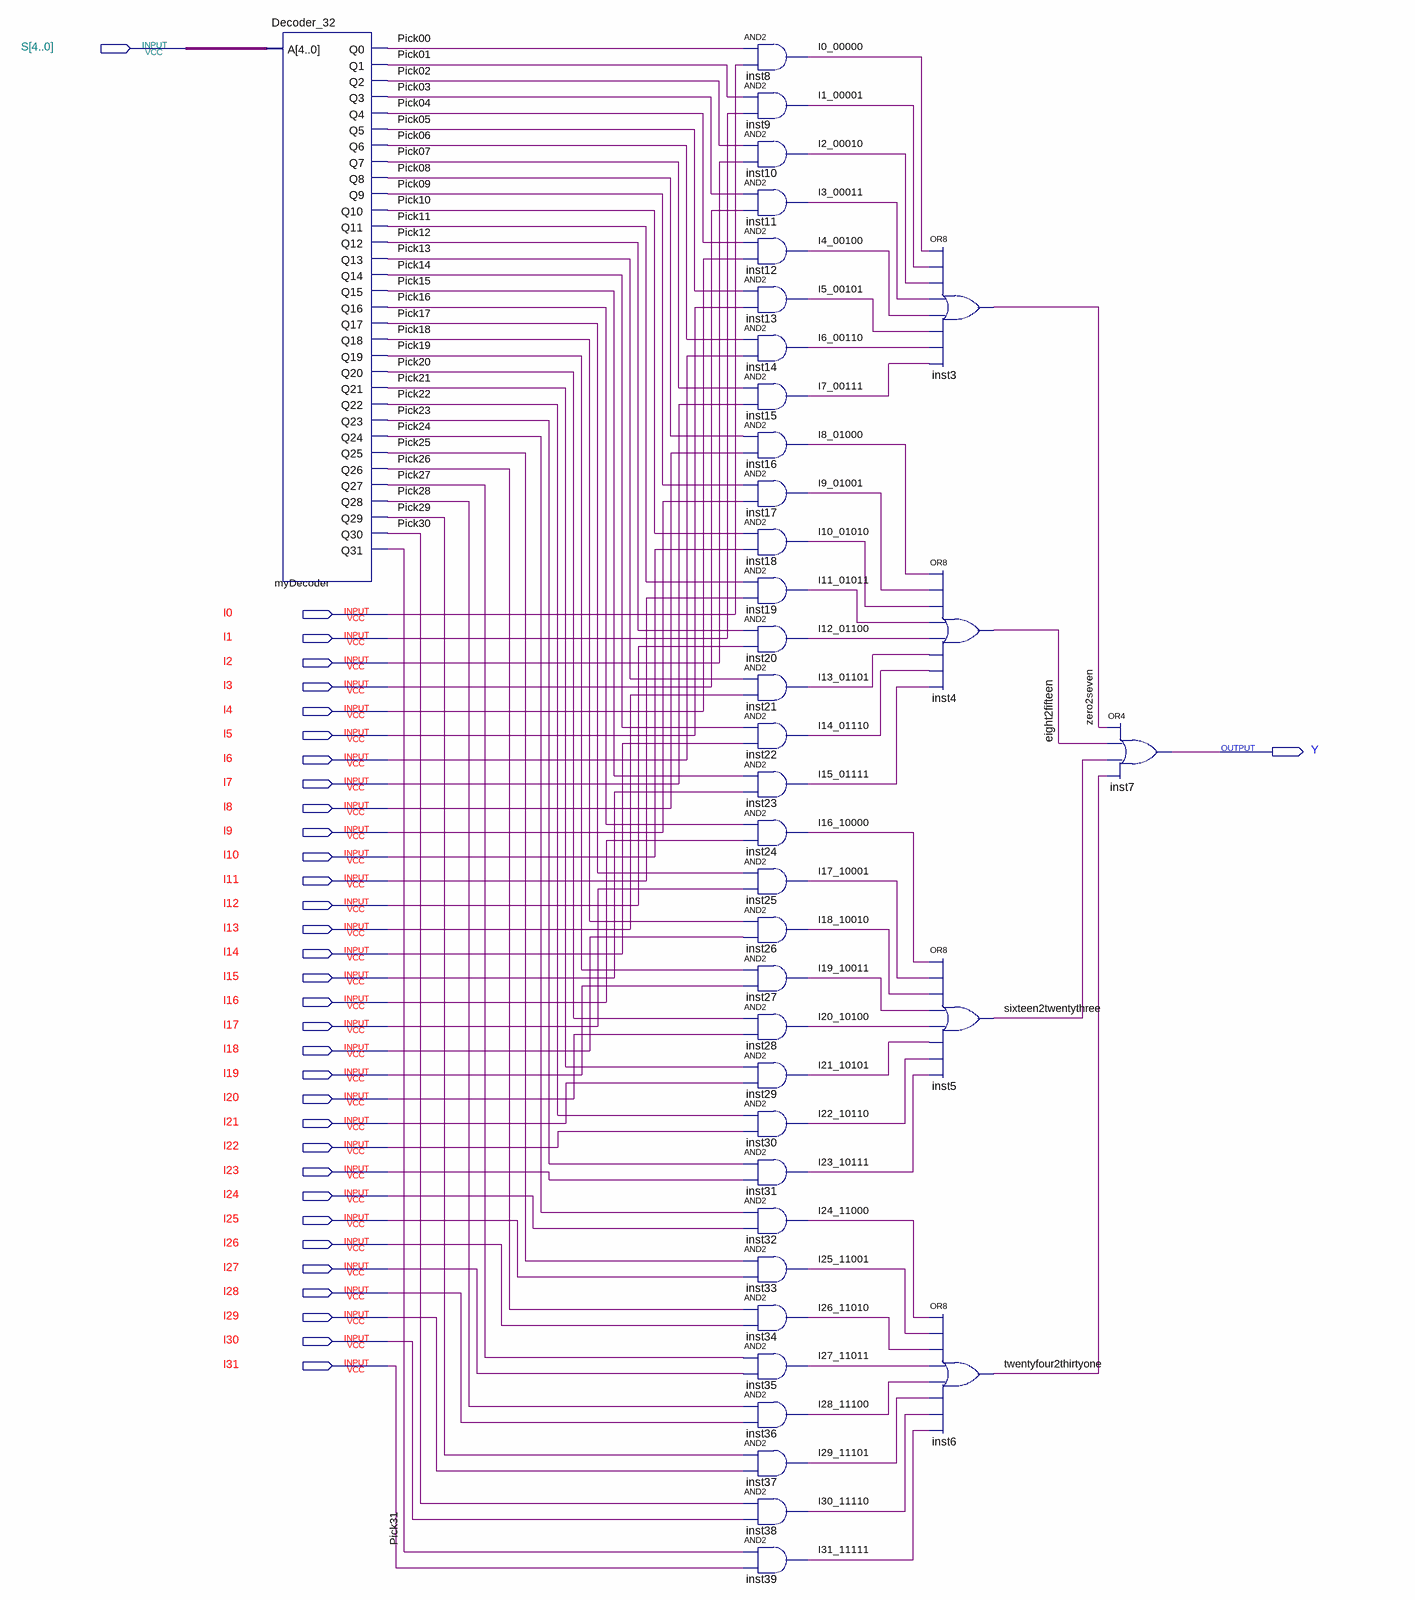
[diagram p0: schematic sheet]
// Quartus schematic MUX32.bdf as structural Verilog: 38 symbols, 34 pins
module MUX32 (
  input  [4:0] S,
  input  I0,
  input  I1,
  input  I2,
  input  I3,
  input  I4,
  input  I5,
  input  I6,
  input  I7,
  input  I8,
  input  I9,
  input  I10,
  input  I11,
  input  I12,
  input  I13,
  input  I14,
  input  I15,
  input  I16,
  input  I17,
  input  I18,
  input  I19,
  input  I20,
  input  I21,
  input  I22,
  input  I23,
  input  I24,
  input  I25,
  input  I26,
  input  I27,
  input  I28,
  input  I29,
  input  I30,
  input  I31,
  output Y
);

  wire eight2fifteen, I0_00000, I1_00001, I2_00010, I3_00011, I4_00100, I5_00101, I6_00110, I7_00111,
       I8_01000, I9_01001, I10_01010, I11_01011, I12_01100, I13_01101, I14_01110, I15_01111, I16_10000,
       I17_10001, I18_10010, I19_10011, I20_10100, I21_10101, I22_10110, I23_10111, I24_11000, I25_11001,
       I26_11010, I27_11011, I28_11100, I29_11101, I30_11110, I31_11111, Pick00, Pick01, Pick02, Pick03,
       Pick04, Pick05, Pick06, Pick07, Pick08, Pick09, Pick10, Pick11, Pick12, Pick13, Pick14, Pick15,
       Pick16, Pick17, Pick18, Pick19, Pick20, Pick21, Pick22, Pick23, Pick24, Pick25, Pick26, Pick27,
       Pick28, Pick29, Pick30, Pick31, sixteen2twentythree, twentyfour2thirtyone, zero2seven;

  Decoder_32 myDecoder (
    .A(S), .Q0(Pick00), .Q1(Pick01), .Q2(Pick02), .Q3(Pick03), .Q4(Pick04), .Q5(Pick05), .Q6(Pick06),
    .Q7(Pick07), .Q8(Pick08), .Q9(Pick09), .Q10(Pick10), .Q11(Pick11), .Q12(Pick12), .Q13(Pick13),
    .Q14(Pick14), .Q15(Pick15), .Q16(Pick16), .Q17(Pick17), .Q18(Pick18), .Q19(Pick19), .Q20(Pick20),
    .Q21(Pick21), .Q22(Pick22), .Q23(Pick23), .Q24(Pick24), .Q25(Pick25), .Q26(Pick26), .Q27(Pick27),
    .Q28(Pick28), .Q29(Pick29), .Q30(Pick30), .Q31(Pick31));
  and inst8 (I0_00000, Pick00, I0);
  and inst9 (I1_00001, Pick01, I1);
  and inst10 (I2_00010, Pick02, I2);
  and inst11 (I3_00011, Pick03, I3);
  and inst12 (I4_00100, Pick04, I4);
  and inst13 (I5_00101, Pick05, I5);
  and inst14 (I6_00110, Pick06, I6);
  and inst15 (I7_00111, Pick07, I7);
  and inst16 (I8_01000, Pick08, I8);
  and inst17 (I9_01001, Pick09, I9);
  and inst18 (I10_01010, Pick10, I10);
  and inst19 (I11_01011, Pick11, I11);
  and inst20 (I12_01100, Pick12, I12);
  and inst21 (I13_01101, Pick13, I13);
  and inst22 (I14_01110, Pick14, I14);
  and inst23 (I15_01111, Pick15, I15);
  and inst24 (I16_10000, Pick16, I16);
  and inst25 (I17_10001, Pick17, I17);
  and inst26 (I18_10010, Pick18, I18);
  and inst27 (I19_10011, Pick19, I19);
  and inst28 (I20_10100, Pick20, I20);
  and inst29 (I21_10101, Pick21, I21);
  and inst30 (I22_10110, Pick22, I22);
  and inst31 (I23_10111, Pick23, I23);
  and inst32 (I24_11000, Pick24, I24);
  and inst33 (I25_11001, Pick25, I25);
  and inst34 (I26_11010, Pick26, I26);
  and inst35 (I27_11011, Pick27, I27);
  and inst36 (I28_11100, Pick28, I28);
  and inst37 (I29_11101, Pick29, I29);
  and inst38 (I30_11110, Pick30, I30);
  and inst39 (I31_11111, Pick31, I31);
  or inst3 (zero2seven, I0_00000, I1_00001, I2_00010, I3_00011, I4_00100, I5_00101, I6_00110, I7_00111);
  or inst4 (eight2fifteen, I8_01000, I9_01001, I10_01010, I11_01011, I12_01100, I13_01101, I14_01110, I15_01111);
  or inst5 (sixteen2twentythree, I16_10000, I17_10001, I18_10010, I19_10011, I20_10100, I21_10101, I22_10110, I23_10111);
  or inst6 (twentyfour2thirtyone, I24_11000, I25_11001, I26_11010, I27_11011, I28_11100, I29_11101, I30_11110, I31_11111);
  or inst7 (Y, zero2seven, eight2fifteen, sixteen2twentythree, twentyfour2thirtyone);
endmodule
